# EAGLE design 0HP EYEtenuator REV 1 (EAGLE 7.6.0)
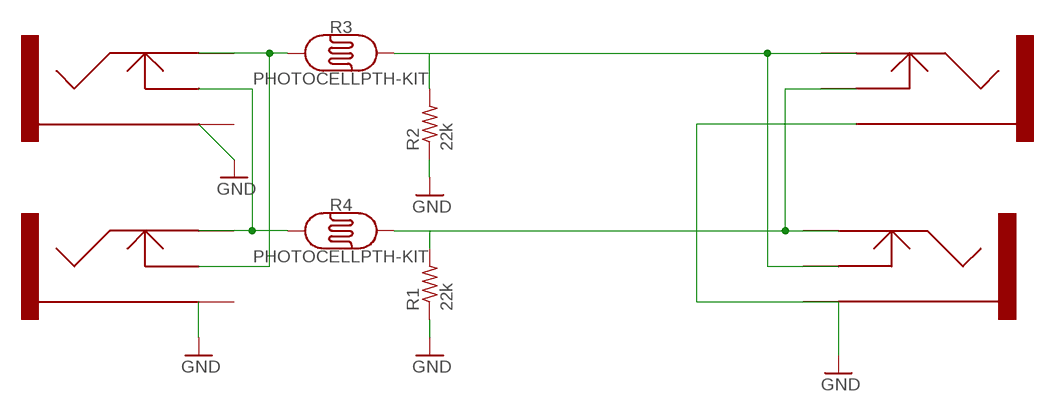
[diagram p0: schematic, sheet 1]

## Parts
CV1  3.5MMJACK  [3.5MMPHONEJACK]
CV2  3.5MMJACK  [3.5MMPHONEJACK]
IN  3.5MMJACK  [3.5MMPHONEJACK]
OUT  3.5MMJACK  [3.5MMPHONEJACK]
R1  22k  R-US_0207/2V  [0207/2V]
R2  22k  R-US_0207/2V  [0207/2V]
R3  PHOTOCELLPTH-KIT  [PHOTOCELL-KIT]
R4  PHOTOCELLPTH-KIT  [PHOTOCELL-KIT]

## Nets
GND: CV1.SLEEVE CV2.SLEEVE IN.SLEEVE OUT.SLEEVE R1.1 R2.1
N$1: IN.TIP OUT.SWITCH R1.2 R4.2
N$2: CV1.SWITCH CV2.TIP R3.1
N$4: CV1.TIP CV2.SWITCH R4.1
N$11: IN.SWITCH OUT.TIP R2.2 R3.2

## Library data of the parts
CV1 CV2 IN OUT = elipech_modified:3.5MMJACK
R1 R2 = resistor:R-US_: RESISTOR, American symbol
R3 R4 = SparkFun-Sensors:PHOTOCELL: Photocell (Photodetector, Photo Resistor, CdS) This is a very small light sensor. A photocell changes (also called a photodetector, photo resistor, CdS or photoconductive cell) resistance depending on the amount of light it is exposed to. These little sensors make great ambient light triggers (when light in the room turns on, do something). Datasheet <http://cdn.sparkfun.com/datasheets/Sensors/LightImaging/SEN-09088.pdf> SparkFun Products Mini Photocell <https://www.sparkfun.com/products/9088> (SEN-09088); PROD_ID: COMP-09129; SF_ID: SEN-09088

## Board
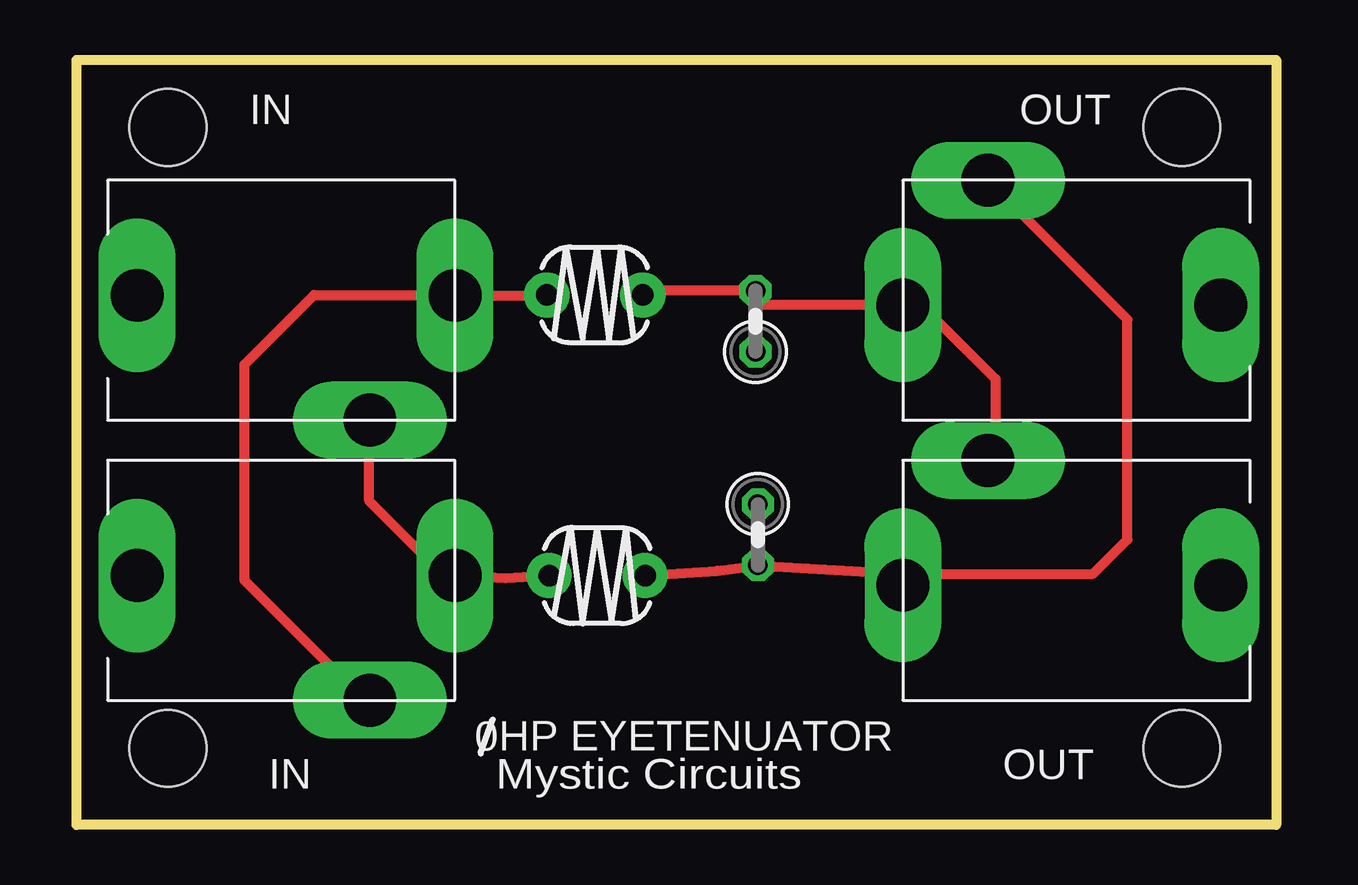
[diagram p1: board, top side]
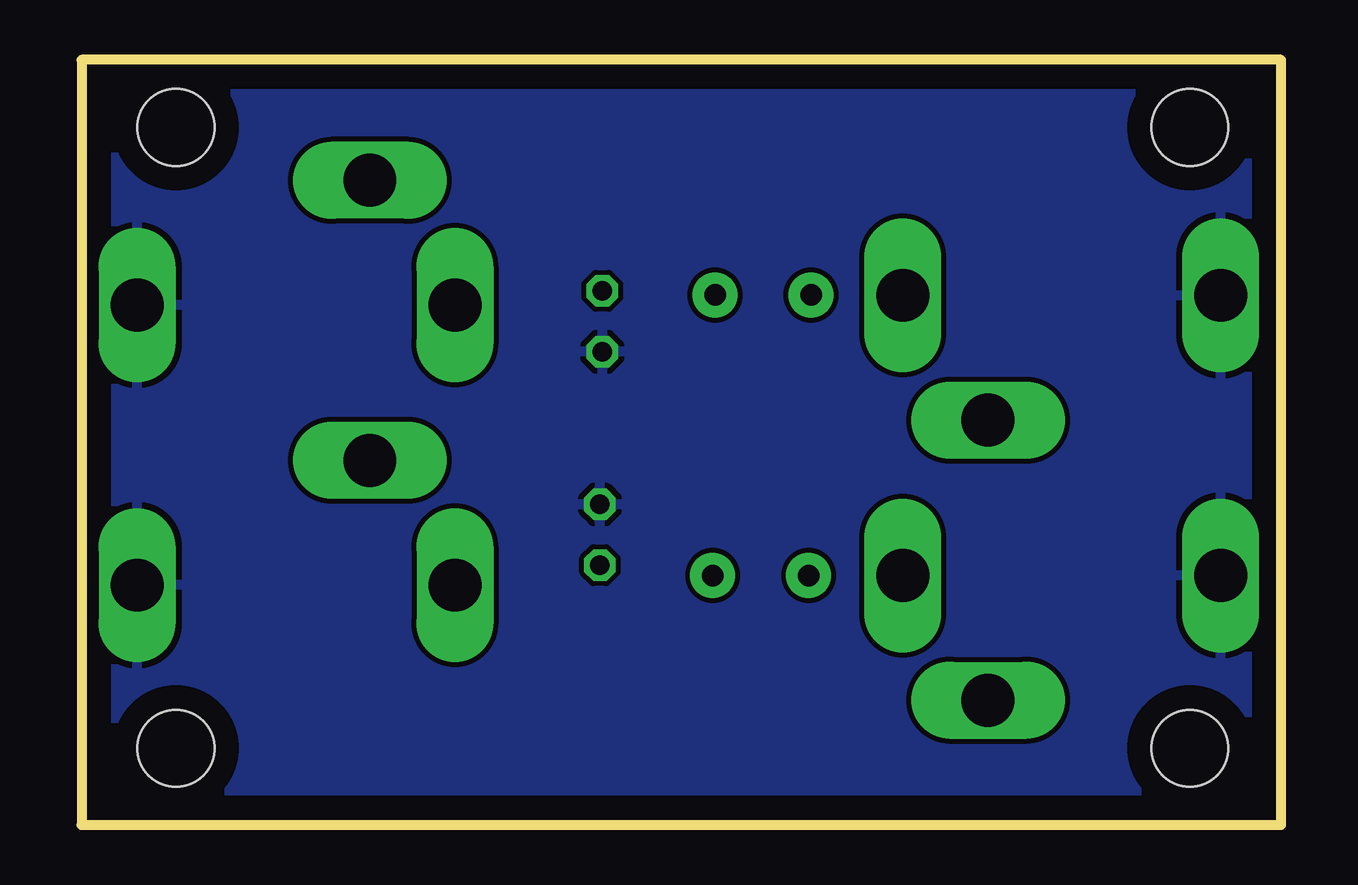
[diagram p2: board, bottom side, seen from below]

Size 50 x 31.89 mm. Coordinates in mm from the lower left corner, seen from the top.
Outline: 0,0 0,31.89 50,31.89 50,0 0,0
Copper layers (1*16): Top 0.035mm / dielectric 1.5mm / Bottom 0.035mm
Design rules "default": minimum track width 10mil, minimum drill 24mil, track to track 8mil, track to pad 8mil, pad to pad 8mil, via to via 8mil, smd to smd 8mil, copper to edge 40mil, drill to drill 8mil, minimum pad ring 10mil, minimum via ring 8mil, stop-mask expansion 4mil, vias tented up to drill 0mil, thermal gap 10mil
Holes 3.2 mm at 3.81,3.2 46.08,3.2 46.08,29.08 3.81,29.08

### Footprints (pad centres in the part's own frame; a part is rotated, then mirrored left to right if it is on the bottom)
3.5MMPHONEJACK = drill 2.2 pad 2.54 long: SLEEVE -5,0.2; SWITCH 4.7,-5; TIP 8.25,0.2
0207/2V = drill 0.813 octagon: 1 -1.27,0; 2 1.27,0
PHOTOCELL-KIT = drill 0.9 pad 1.88: 1 -2,0; 2 2,0

### Placement (x,y rotation side)
CV1  7.53,10.2 0 top
CV2  7.53,21.88 0 top
IN  42.69,10.2 180 top
OUT  42.69,21.88 180 top
R1  28.4,12.1 270 top
R2  28.3,21 90 top
R3  21.6,22.1 0 top
R4  21.7,10.4 0 top

### Tracks (layer width: path | path; a pad name or v marks a point on that pad's centre or on a via)
GND
  pour Bottom: 0.28,0.14 0.1,31.87 50.1,31.62 50,0
N$1
  Top 0.406: R4.2 26.7,10.6 R1.2 34.44,10.47 | 34.44,10.47 IN.TIP | 34.44,10.47 42.37,10.47 43.8,11.9 43.8,21.07 OUT.SWITCH
N$2
  Top 0.406: R3.1 19.6,22.08 CV2.TIP 15.76,22.1 9.9,22.1 7,19.2 7,10.2 12,5.2 CV1.SWITCH
N$4
  Top 0.406: R4.1 17.9,10.3 CV1.TIP 15.3,10.4 12.2,13.5 12.2,16.86 CV2.SWITCH
N$11
  Top 0.406: R3.2 23.6,22.27 R2.2 28.3,21.68 OUT.TIP 35.22,21.68 38.3,18.6 38.3,15.51 IN.SWITCH

### Text on the board
tPlace: IN | OUT | 0HP EYETENUATOR | IN | Mystic Circuits | OUT
200bmp: C:/Users/eil/Documents/bidness/front panels/0HP/0HP EYEtenuator eye.bmp